# EAGLE schematic PCB_2.1 (EAGLE 8.6.3)
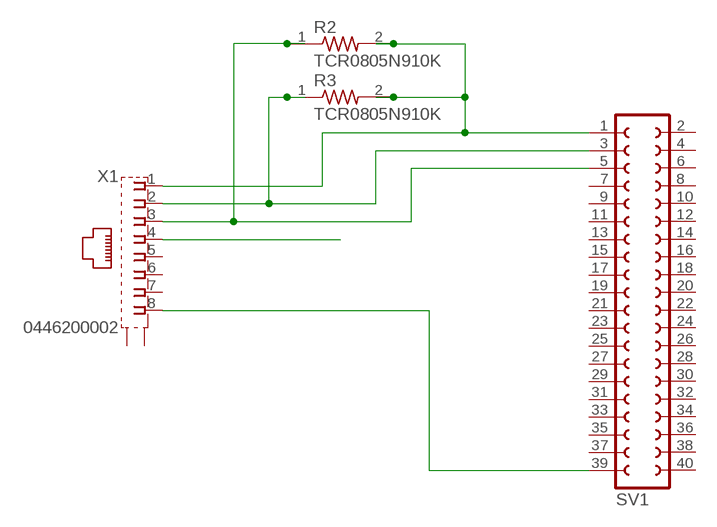
[diagram p0: schematic, sheet 1]

## Parts
R2  TCR0805N910K  [RESC2012X65N]
R3  TCR0805N910K  [RESC2012X65N]
SV1  FE20-2  [FE20-2]
X1  0446200002  [0446200002]

## Nets
3V3: R2.2 R3.2 SV1.1 X1.1
N$1: X1.4
N$2: SV1.39 X1.8
SCL: R2.1 SV1.5 X1.3
SDA: R3.1 SV1.3 X1.2
Unconnected: SV1.2 SV1.4 SV1.6 SV1.7 SV1.8 SV1.9 SV1.10 SV1.11 SV1.12 SV1.13 SV1.14 SV1.15 SV1.16 SV1.17 SV1.18 SV1.19 SV1.20 SV1.21 SV1.22 SV1.23 SV1.24 SV1.25 SV1.26 SV1.27 SV1.28 SV1.29 SV1.30 SV1.31 SV1.32 SV1.33 SV1.34 SV1.35 SV1.36 SV1.37 SV1.38 SV1.40 X1.5 X1.6 X1.7 X1.S@1(S1) X1.S@2(S2)

## Library data of the parts
R2 R3 = TCR0805N910K:TCR0805N910K: Res Thick Film 0805 910K Ohm -10% to 0% 1/10W ±200ppm/°C Molded SMD T/R; AVAILABILITY: Unavailable; COMMENT: 1623707-7; DESCRIPTION: Res Thick Film 0805 910K Ohm -10% to 0% 1/10W ±200ppm/°C Molded SMD T/R; MF: TE Connectivity; MP: TCR0805N910K; PACKAGE: 0805 TE Connectivity; PRICE: None; TE_PURCHASE_URL: https://www.te.com/usa-en/product-1623707-7.html?te_bu=Cor&te_type=disp&te_campaign=seda_glo_cor-seda-global-disp-prtnr-fy19-seda-model-bom-cta_sma-317_1&elqCampaignId=32493
SV1 = con-lsta:FE20-2: FEMALE HEADER; OC_FARNELL: unknown; OC_NEWARK: unknown
X1 = 0446200002:0446200002: RJ-45 INVERTED MODULAR JACK ASSEMBLY WITH RJ-11 KEEPOUT FEATURE Source: Data sheet <http://www.farnell.com/datasheets/73207.pdf> MOLEX 0446200002 BUCHSE, RJ45, GESCHIRMT Source: Farnell <http://de.farnell.com/molex/0446200002/buchse-rj45-geschirmt/dp/9251910?ost=9251910>; AVAILABILITY: Unavailable; DESCRIPTION: Conn RJ-45 RCP 8 POS 2.04mm Solder RA Thru-Hole 8 Terminal 1 Port Tray Cat 3; MF: Molex, LLC; MP: 0446200002; PACKAGE: None; PRICE: None

## Module BUZZER
Ports: 

### Library data of the parts